# Altium schematic sheet LoraRFM.SchDoc
size A4; SheetNumber: 4; SheetTotal: 6
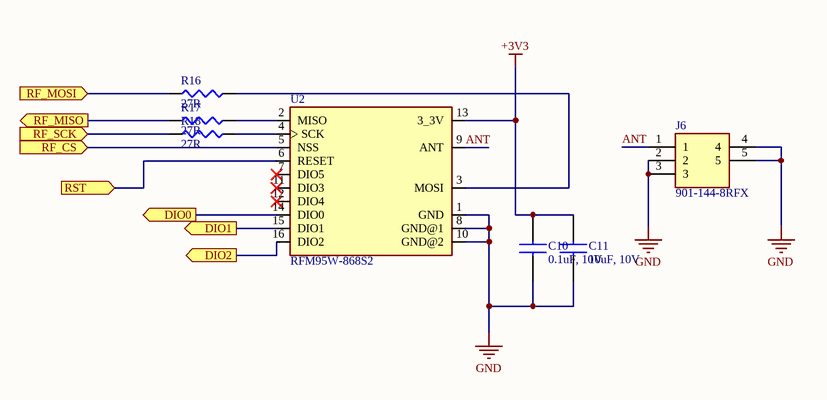
[diagram p0: LoraRFM.SchDoc]

## Parts
C10  0.1uF, 10V  [CAPC1608X90N]
C11  10uF, 10V  [CAPC1608X90N]
J6  901-144-8RFX  [9011448RFX]
R16  27R  [RESC1607X60N]
R17  27R  [RESC1607X60N]
R18  27R  [RESC1607X60N]
U2  RFM95W-868S2  [XCVR_RFM95W-868S2]

## Ports
DIO0 (out), DIO1 (out), DIO2 (out), RF_CS (in), RF_MISO (out), RF_MOSI (in), RF_SCK (in), RST (in)

## Nets
+3V3: C10.2 C11.2 U2.13(3_3V)
GND: C10.1 C11.1 J6.2 J6.3 J6.4 J6.5 U2.1(GND) U2.8(GND@1) U2.10(GND@2)
ANT: J6.1 U2.9(ANT)
DIO0: U2.14(DIO0) ; port DIO0
DIO1: U2.15(DIO1) ; port DIO1
DIO2: U2.16(DIO2) ; port DIO2
RF_CS: U2.5(NSS) ; port RF_CS
RF_MISO: R17.1 ; port RF_MISO
RF_MOSI: R16.1 ; port RF_MOSI
RF_SCK: R18.1 ; port RF_SCK
RST: U2.6(RESET) ; port RST
NetR16_2: R16.2 U2.3(MOSI)
NetR17_2: R17.2 U2.2(MISO)
NetR18_2: R18.2 U2.4(SCK)

Not connected (* = marked no-connect by the designer): U2 7(DIO5)* 11(DIO3)* 12(DIO4)*

## Library data of the parts
C10 = C0603C104K8RACTU: CAP CER 0.1UF 10V X7R 0603; Manufacturer_Name: KEMET; Datasheet Link: https://componentsearchengine.com/Datasheets/2/CL10A106MP8NNNC.pdf; Height: 0.9mm; Manufacturer_Part_Number: C0603C104K8RACTU; Mouser Part Number: 187-CL10A106MP8NNNC; Mouser Price/Stock: https://www.mouser.co.uk/ProductDetail/Samsung-Electro-Mechanics/CL10A106MP8NNNC?qs=X6jEic%2FHinAgjcVTZfg7UA%3D%3D; Arrow Part Number: CL10A106MP8NNNC; Arrow Price/Stock: https://www.arrow.com/en/products/cl10a106mp8nnnc/samsung-electro-mechanics?utm_currency=USD&region=europe
C11 = CL10A106MP8NNNC: CAP CER 10UF 10V X5R 0603; Manufacturer_Name: SAMSUNG; Datasheet Link: https://componentsearchengine.com/Datasheets/2/CL10A106MP8NNNC.pdf; Height: 0.9mm; Manufacturer_Part_Number: CL10A106MP8NNNC; Mouser Part Number: 187-CL10A106MP8NNNC; Mouser Price/Stock: https://www.mouser.co.uk/ProductDetail/Samsung-Electro-Mechanics/CL10A106MP8NNNC?qs=X6jEic%2FHinAgjcVTZfg7UA%3D%3D; Arrow Part Number: CL10A106MP8NNNC; Arrow Price/Stock: https://www.arrow.com/en/products/cl10a106mp8nnnc/samsung-electro-mechanics?utm_currency=USD&region=europe
J6 = 901-144-8RFX: Connector; Manufacturer_Name: Amphenol; Datasheet Link: https://componentsearchengine.com/Datasheets/1/901-144-8RFX.pdf; Height: 9.53mm; Manufacturer_Part_Number: 901-144-8RFX; Mouser Part Number: 523-901-144-8RFX; Mouser Price/Stock: https://www.mouser.co.uk/ProductDetail/Amphenol-RF/901-144-8RFX?qs=jpOL8GWAqat%252BbPjbt8toTg%3D%3D; Arrow Part Number: 901-144-8RFX; Arrow Price/Stock: https://www.arrow.com/en/products/901-144-8rfx/amphenol-rf?region=europe
R16-R18 = RC0603JR-0727RL: RES 27 OHM 5% 1/10W 0603; Manufacturer: Yageo; Voltage Rating (AC): 50V; Supplier 1: Digikey; Manufacturer Part Number: RC0603JR-0727RL; RoHS: Yes; Category: Chip SMD Resistors; Stock 1: 235857; Pricing 1: 1=0,1, 10=0,008, 50=0,0072, 100=0,0061, 500=0,00562, 1000=0,0051 (USD); Lead Free: 5697LeadFree; ComponentLink1URL: https://datasheet.ciiva.com/7746/443971-7746479.pdf?src-supplier=Element14; ComponentLink1Description: https://datasheet.ciiva.com/7746/443971-7746479.pdf?src-supplier=Element14
U2 = RFM95W-868S2: General ISM < 1GHz LoRaâ„¢ Transceiver Module 868MHz Antenna Not Included Surface Mount; MF: RF; Package: Non Standard RF Solutions; Price: None; Check_prices: https://www.snapeda.com/parts/RFM95W-868S2/RF+Solutions/view-part/?ref=eda; Value: *; SnapEDA_Link: https://www.snapeda.com/parts/RFM95W-868S2/RF+Solutions/view-part/?ref=snap; MP: RFM95W-868S2; Availability: In Stock; Purchase-URL: https://pricing.snapeda.com/search?q=RFM95W-868S2&ref=eda